# Altium schematic sheet Ball Gripper Circuits.SchDoc
size A4
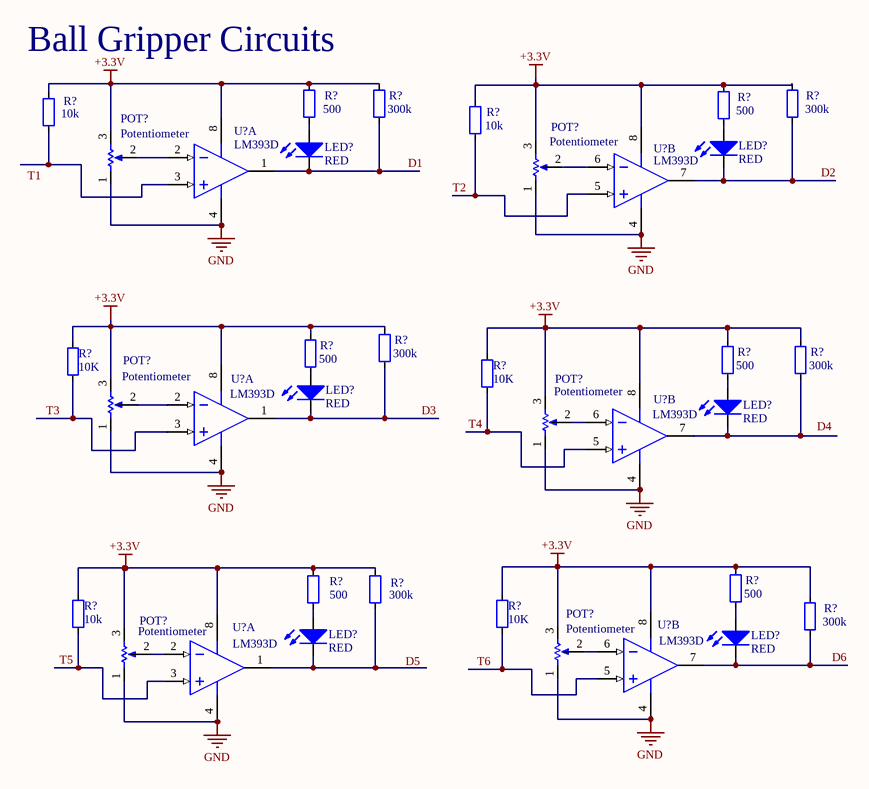
[diagram p0: Ball Gripper Circuits.SchDoc]

## Parts
(Parts that share a designator on the sheet are numbered #1, #2 ... from top to bottom, then left to right.)
LED?#1  RED  [0603_led_red]
LED?#2  RED  [0603_led_red]
LED?#3  RED  [0603_led_red]
LED?#4  RED  [0603_led_red]
LED?#5  RED  [0603_led_red]
LED?#6  RED  [0603_led_red]
POT?#1  Potentiometer  [Pot_3296]
POT?#2  Potentiometer  [Pot_3296]
POT?#3  Potentiometer  [Pot_3296]
POT?#4  Potentiometer  [Pot_3296]
POT?#5  Potentiometer  [Pot_3296]
POT?#6  Potentiometer  [Pot_3296]
R?#1  500  [0603]
R?#2  300k  [0603]
R?#3  500  [0603]
R?#4  300k  [0603]
R?#5  10k  [0603]
R?#6  10k  [0603]
R?#7  300k  [0603]
R?#8  500  [0603]
R?#9  10K  [0603]
R?#10  500  [0603]
R?#11  300k  [0603]
R?#12  10K  [0603]
R?#13  500  [0603]
R?#14  300k  [0603]
R?#15  500  [0603]
R?#16  10k  [0603]
R?#17  10K  [0603]
R?#18  300k  [0603]
U?#1  LM393D  [SO8_N]  (part A of 2)
U?#2  LM393D  [SO8_N]  (part B of 2)
U?#3  LM393D  [SO8_N]  (part A of 2)
U?#4  LM393D  [SO8_N]  (part B of 2)
U?#5  LM393D  [SO8_N]  (part A of 2)
U?#6  LM393D  [SO8_N]  (part B of 2)

## Nets
+3.3V: POT?#1.3 POT?#2.3 POT?#3.3 POT?#4.3 POT?#5.3 POT?#6.3 R?#1.2 R?#2.2 R?#3.2 R?#4.2 R?#5.2 R?#6.2 R?#7.2 R?#8.2 R?#9.2 R?#10.2 R?#11.2 R?#12.2 R?#13.2 R?#14.2 R?#15.2 R?#16.2 R?#17.2 R?#18.2 U?#1.8(V+) U?#2.8(V+) U?#3.8(V+) U?#4.8(V+) U?#5.8(V+) U?#6.8(V+)
GND: POT?#1.1 POT?#2.1 POT?#3.1 POT?#4.1 POT?#5.1 POT?#6.1 U?#1.4(V-) U?#2.4(V-) U?#3.4(V-) U?#4.4(V-) U?#5.4(V-) U?#6.4(V-)
D1: LED?#2.2(K) R?#2.1 U?#1.1(OUT)
D2: LED?#1.2(K) R?#4.1 U?#2.7(OUT)
D3: LED?#3.2(K) R?#7.1 U?#3.1(OUT)
D6: LED?#6.2(K) R?#18.1 U?#6.7(OUT)
T2: R?#6.1 U?#2.5(IN+)
T3: R?#9.1 U?#3.3(IN+)
T4: R?#12.1 U?#4.5(IN+)
T5: R?#16.1 U?#5.3(IN+)
T6: R?#17.1 U?#6.5(IN+)
NetLED?#1_1: LED?#1.1(A) R?#3.1
NetLED?#2_1: LED?#2.1(A) R?#1.1
NetLED?#3_1: LED?#3.1(A) R?#8.1
NetLED?#4_1: LED?#4.1(A) R?#10.1
NetLED?#4_2: LED?#4.2(K) R?#11.1 U?#4.7(OUT)
NetLED?#5_1: LED?#5.1(A) R?#13.1
NetLED?#5_2: LED?#5.2(K) R?#14.1 U?#5.1(OUT)
NetLED?#6_1: LED?#6.1(A) R?#15.1
NetPOT?#1_2: POT?#1.2 U?#1.2(IN-)
NetPOT?#2_2: POT?#2.2 U?#2.6(IN-)
NetPOT?#3_2: POT?#3.2 U?#3.2(IN-)
NetPOT?#4_2: POT?#4.2 U?#4.6(IN-)
NetPOT?#5_2: POT?#5.2 U?#5.2(IN-)
NetPOT?#6_2: POT?#6.2 U?#6.6(IN-)
NetR?#5_1: R?#5.1 U?#1.3(IN+)

## Notes on the sheet
- (near R?#2) Ball Gripper Circuits
- Labels drawn without touching a wire or pin: D4, D5, T1

## Library data of the parts
LED?#1-LED?#6 = LED: Light-emitting diode; COLOR: RED
R?#1-R?#18 = RES: Resistior
  R?#1 R?#3 R?#8 R?#10 R?#13 R?#15: Value: 500
  R?#2 R?#4 R?#7 R?#11 R?#14 R?#18: Value: 300k
  R?#5 R?#6 R?#16: Value: 10k
  R?#9 R?#12 R?#17: Value: 10K
U?#1-U?#6 = LM393D: Low-Power Dual Voltage Comparator; Published: 24-Aug-2001; LatestRevisionDate: 13-Apr-2006; LatestRevisionNote: IPC-7351 Footprint Added.; DatasheetVersion: Jun-1998; PackageVersion: Dec-2002; PackageReference: SO8; Publisher: Altium Limited; PackageDescription: 8-Pin Small Outline Integrated Circuit 1.27 mm Pitch; Code_JEDEC: MS-012-AA; Code_IPC: SOIC127P600-8; ComponentLink1Description: Manufacturer Link; ComponentLink1URL: http://www.st.com/; ComponentLink2Description: Datasheet; ComponentLink2URL: http://www.st.com/stonline/products/literature/ds/2164/lm293.pdf